# Altium schematic sheet Mechanical.SchDoc: Mechanical
size A4; Date: Not used; ApprovedBy: Not used; CheckedBy: Not used; Author: Not used; CompanyName: STMicroelectronics; DrawnBy: Not used; Engineer: Not used; Organization: Not used; Address1: Not used; Address2: Not used; Address3: Not used; Address4: Not used; DocumentNumber: 8; Revision: Not used; SheetNumber: 8; SheetTotal: 8; CurrentTime: Not used; CurrentDate: Not used; Time: Not used; DocumentFullPathAndName: Not used; DocumentName: Not used; ModifiedDate: Not used; ImagePath: Not used; ProjectName: Not used; Application_BuildNumber: Not used
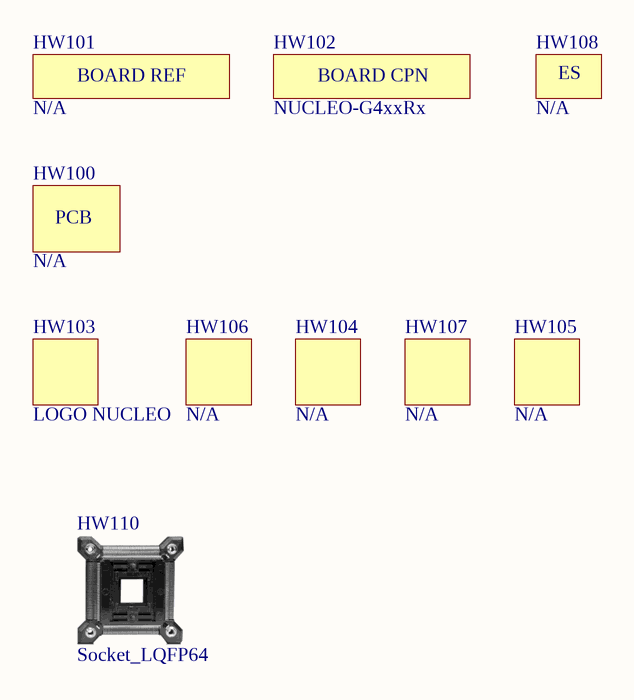
[diagram p0: Mechanical.SchDoc]

## Parts
HW100  (no value)  (no BOM)
HW101  (no value)  [STICKER_25X9]  (mechanical)
HW102  value NUCLEO-G4xxRx  (no BOM)
HW103  value LOGO NUCLEO  [LOGO_NUCLEO]  (no BOM)
HW104  (no value)  [LOGO_CE]  (no BOM)
HW105  (no value)  [LOGO_ROHS]  (no BOM)
HW106  (no value)  [LOGO_ST]  (no BOM)
HW107  (no value)  [LOGO_MAIN_1]  (no BOM)
HW108  (no value)  (mechanical)
HW110  SOCKET_LQFP64  (mechanical)

## Notes on the sheet
- Title:
- Project:
- Size:
- Revision:
- Variant:
- A4
- -
- Date:
- Reference:
- Sheet:
- of
- (in symbol MCD-00234) ES
- (in symbol MCD-00235) BOARD REF
- (in symbol MCD-00549) BOARD CPN

## Library data of the parts
HW100 = MCD-00216: PCB, xxxx for PCB number, Y for PCB revision; Part_Type: Misc; Part_Preference: Forbidden; Provided_By: SUBCO; Component_Country_Of_Origin: Unknown; ID: 2653; ShowFields: YES; Internal_Part_Number: MCD-00216; Value: N/A; Status: Released; ECCN_US: n/a; ECCN_EU: n/a; Manufacturer_Part_Number: n/a; Manufacturer: n/a; ComponentLink1Description: Datasheet; ComponentLink1URL: http://tunmcdsvn.tun.st.com/Component_Documentation_Library/Trunk; Order_Code_Digikey: N/A; Order_Code_Farnell: N/A; Order_Code_RS: N/A
HW101 = MCD-00235: Sticker to mention board reference + serial number; Part_Type: Misc; Part_Preference: Recommended; Provided_By: SUBCO; Component_Country_Of_Origin: Unknown; ID: 2632; ShowFields: YES; Internal_Part_Number: MCD-00235; Value: N/A; ECCN_US: n/a; ECCN_EU: n/a; Status: Released; Manufacturer_Part_Number: n/a; Manufacturer: n/a; ComponentLink1Description: Datasheet; ComponentLink1URL: http://tunmcdsvn.tun.st.com/Component_Documentation_Library/Trunk; Order_Code_Digikey: N/A; Order_Code_Farnell: N/A; Order_Code_RS: N/A
HW102 = MCD-00549: Product sticker to mention product CPN + product FG; Part_Type: Mechanical; Provided_By: Subcon; Initial_Board_Reference: MB1319; Internal_Part_Number: MCD-00549; ECCN_US: n/a; ECCN_EU: n/a; Status: Released
HW103 = MCD-00636: NUCLEO logo footprint for PCB; Part_Type: Accessory; Part_Preference: Forbidden; Component_Country_Of_Origin: Unknown; ID: 3110; ShowFields: YES; Internal_Part_Number: MCD-00636; Status: Obsolete; ECCN_US: n/a; ECCN_EU: n/a; Provided_By: n/a; Manufacturer_Part_Number: N/A; Manufacturer: N/A; ComponentLink1Description: Datasheet; Manufacturer_HQ_COO: Unknown; Order_Code_Digikey: N/A; Order_Code_Farnell: N/A; Order_Code_RS: N/A
HW104 = MCD-00626: CE logo footprint for PCB; Part_Type: Misc; Part_Preference: Forbidden; Component_Country_Of_Origin: Unknown; ID: 3116; ShowFields: YES; Internal_Part_Number: MCD-00626; Value: N/A; Status: Obsolete; ECCN_US: n/a; ECCN_EU: n/a; Provided_By: n/a; Manufacturer_Part_Number: N/A; Manufacturer: N/A; ComponentLink1Description: Datasheet; ComponentLink1URL: http://tunmcdsvn.tun.st.com/Component_Documentation_Library/Trunk; Manufacturer_HQ_COO: Unknown; Order_Code_Digikey: N/A; Order_Code_Farnell: N/A; Order_Code_RS: N/A
HW105 = MCD-00628: ROHS logo footprint for PCB; Part_Type: Misc; Part_Preference: Forbidden; Component_Country_Of_Origin: Unknown; ID: 3120; ShowFields: YES; Internal_Part_Number: MCD-00628; Value: N/A; Status: Obsolete; ECCN_US: n/a; ECCN_EU: n/a; Provided_By: n/a; Manufacturer_Part_Number: N/A; Manufacturer: N/A; ComponentLink1Description: Datasheet; ComponentLink1URL: http://tunmcdsvn.tun.st.com/Component_Documentation_Library/Trunk; Manufacturer_HQ_COO: Unknown; Order_Code_Digikey: N/A; Order_Code_Farnell: N/A; Order_Code_RS: N/A
HW106 = MCD-00625: STMicroelectronics logo footprint for PCB; Part_Type: Misc; Part_Preference: Forbidden; Component_Country_Of_Origin: Unknown; ID: 3117; ShowFields: YES; Internal_Part_Number: MCD-00625; Value: N/A; Status: Obsolete; ECCN_US: n/a; ECCN_EU: n/a; Provided_By: n/a; Manufacturer_Part_Number: N/A; Manufacturer: N/A; ComponentLink1Description: Datasheet; ComponentLink1URL: http://tunmcdsvn.tun.st.com/Component_Documentation_Library/Trunk/Misc; Manufacturer_HQ_COO: Unknown; Order_Code_Digikey: N/A; Order_Code_Farnell: N/A; Order_Code_RS: N/A
HW107 = MCD-00627: Hand ESD logo footprint for PCB; Part_Type: Misc; Part_Preference: Forbidden; Component_Country_Of_Origin: Unknown; ID: 3114; ShowFields: YES; Internal_Part_Number: MCD-00627; Value: N/A; Status: Obsolete; ECCN_US: n/a; ECCN_EU: n/a; Provided_By: n/a; Manufacturer_Part_Number: N/A; Manufacturer: N/A; ComponentLink1Description: Datasheet; ComponentLink1URL: http://tunmcdsvn.tun.st.com/Component_Documentation_Library/Trunk/Misc; Manufacturer_HQ_COO: Unknown; Order_Code_Digikey: N/A; Order_Code_Farnell: N/A; Order_Code_RS: N/A
HW108 = MCD-00234: Sticker to mention ES sample; Part_Type: Misc; Part_Preference: Recommended; Provided_By: SUBCO; Component_Country_Of_Origin: Unknown; ID: 2634; ShowFields: YES; Internal_Part_Number: MCD-00234; Value: N/A; Status: Released; ECCN_US: n/a; ECCN_EU: n/a; Manufacturer_Part_Number: n/a; Manufacturer: n/a; ComponentLink1Description: Datasheet; ComponentLink1URL: http://tunmcdsvn.tun.st.com/Component_Documentation_Library/Trunk; Order_Code_Digikey: N/A; Order_Code_Farnell: N/A; Order_Code_RS: N/A
HW110 = MCD-01253: Yamaichi socket for LQFP64, with positioning pins.; Part_Type: Socket_IC; Manufacturer_Part_Number: IC149-064-169-B5; Part_Preference: Forbidden; Provided_By: SUBCO; Component_Country_Of_Origin: Unknown; ID: 3244; ShowFields: YES; Internal_Part_Number: MCD-01253; Value: Socket_LQFP64; Status: Released; Manufacturer: YAMAICHI; ComponentLink1Description: Datasheet; ComponentLink1URL: http://tunmcdsvn.tun.st.com/Component_Documentation_Library/Trunk/Socket_IC/YAMAICHI_IC149-064-169-B5; ECCN_US: n/a; ECCN_EU: n/a; Manufacturer_HQ_COO: Unknown; Order_Code_Digikey: N/A; Order_Code_Farnell: N/A; Order_Code_RS: N/A; Package: LQFP64